# Altium schematic sheet main.SchDoc
size 223 x 203 mm; SheetNumber: 1; SheetTotal: 13
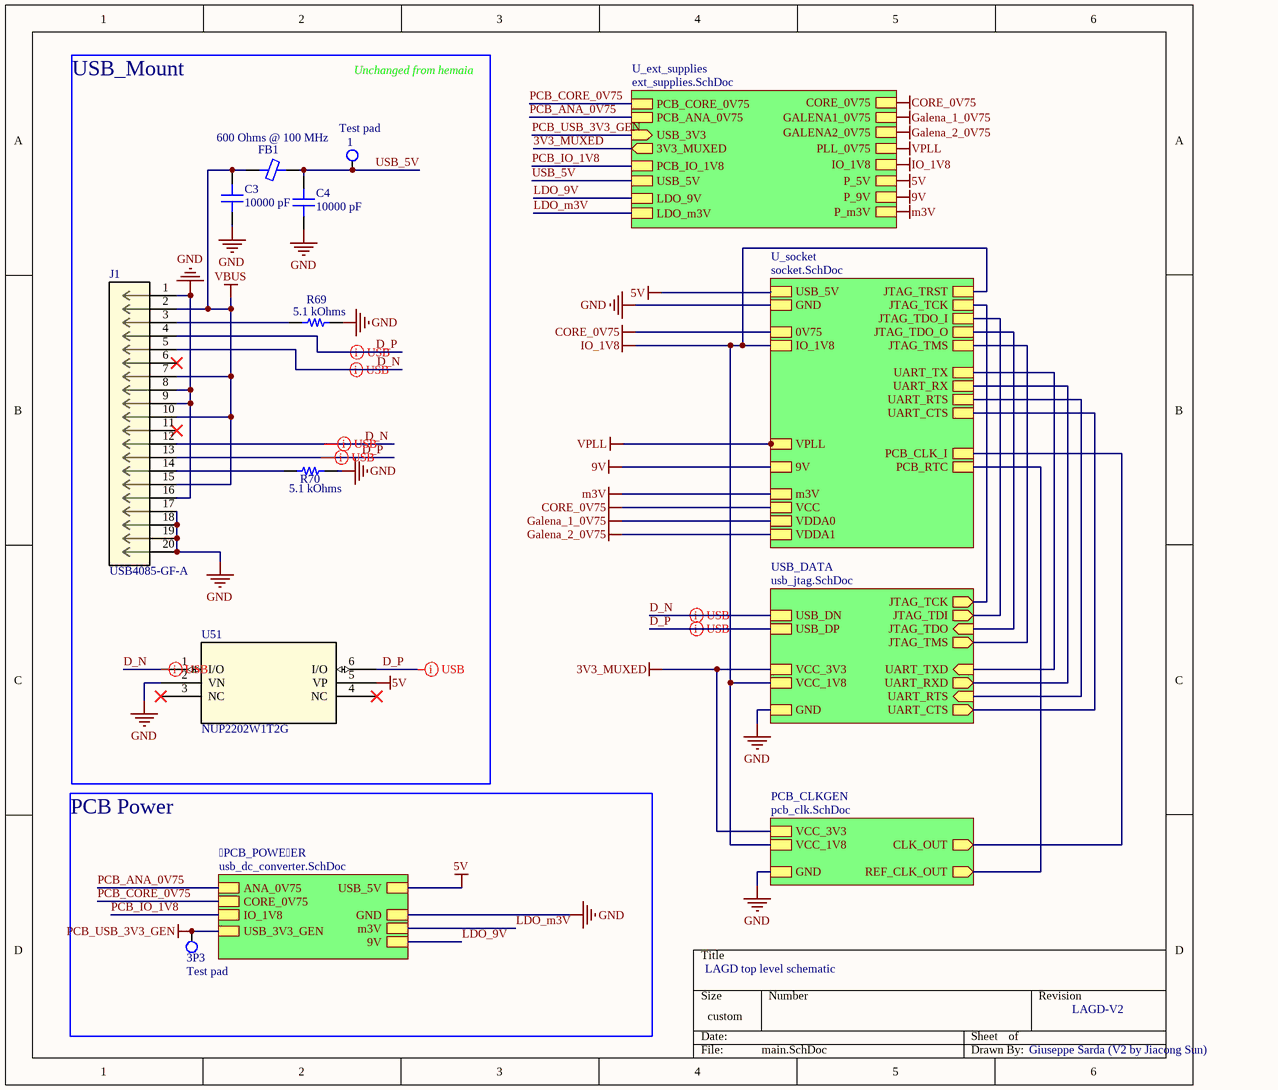
[diagram p0: main.SchDoc]

## Parts
1  Test pad  [Test Pad]
3P3  Test pad  [Test Pad]
C3  10000 pF  [CAP 0805_2012]
C4  10000 pF  [CAP 0805_2012]
FB1  600 Ohms @ 100 MHz  [FER 0805_2012]
J1  USB4085-GF-A  [FP-USB4085-GF-A-MFG]
R69  5.1 kOhms  [RES 0805_2012]
R70  5.1 kOhms  [RES 0805_2012]
U51  NUP2202W1T2G  [SOT-363-6_2P2X1P35_ONS]

## Blocks framed on the sheet
USB_Mount: 1 C3 C4 FB1 J1 R69 R70 U51
PCB Power: 3P3

## Sub-sheets
PCB_POWEER = usb_dc_converter.SchDoc: GND, USB_5V, ANA_0V75, CORE_0V75, IO_1V8, m3V, 9V, USB_3V3_GEN
PCB_CLKGEN = pcb_clk.SchDoc: VCC_3V3, VCC_1V8, GND, CLK_OUT (out), REF_CLK_OUT (out)
U_ext_supplies = ext_supplies.SchDoc: PCB_CORE_0V75, CORE_0V75, PCB_ANA_0V75, GALENA1_0V75, GALENA2_0V75, PLL_0V75, PCB_IO_1V8, IO_1V8, USB_5V, P_5V, LDO_9V, P_9V, LDO_m3V, P_m3V, USB_3V3 (in), 3V3_MUXED (out)
U_socket = socket.SchDoc: USB_5V, GND, 9V, 0V75, IO_1V8, VDDA1, PCB_RTC, PCB_CLK_I, UART_RTS, UART_TX, UART_RX, UART_CTS, JTAG_TCK, JTAG_TMS, JTAG_TDO_I, JTAG_TRST, JTAG_TDO_O, VCC, VDDA0, m3V, VPLL
USB_DATA = usb_jtag.SchDoc: VCC_1V8, VCC_3V3, GND, USB_DN, USB_DP, JTAG_TCK (out), JTAG_TDI (out), JTAG_TDO (in), JTAG_TMS (out), UART_TXD (in), UART_RXD (out), UART_RTS (in), UART_CTS (out)

## Nets
3V3_MUXED: sheet USB_DATA/VCC_3V3, sheet PCB_CLKGEN/VCC_3V3, sheet U_ext_supplies/3V3_MUXED
5V: U51.5(VP) ; sheet PCB_POWEER/USB_5V, sheet U_socket/USB_5V, sheet U_ext_supplies/P_5V
9V: sheet U_socket/9V, sheet U_ext_supplies/P_9V
CORE_0V75: sheet U_socket/0V75, sheet U_socket/VCC, sheet U_ext_supplies/CORE_0V75
Galena_1_0V75: sheet U_socket/VDDA0, sheet U_ext_supplies/GALENA1_0V75
Galena_2_0V75: sheet U_socket/VDDA1, sheet U_ext_supplies/GALENA2_0V75
GND: C3.2 C4.2 J1.1 J1.8 J1.9 J1.16 J1.17 J1.18 J1.19 J1.20 R69.2 R70.2 U51.2(VN) ; sheet USB_DATA/GND, sheet PCB_CLKGEN/GND, sheet PCB_POWEER/GND, sheet U_socket/GND
IO_1V8: sheet USB_DATA/VCC_1V8, sheet PCB_CLKGEN/VCC_1V8, sheet U_socket/IO_1V8, sheet U_socket/JTAG_TRST, sheet U_ext_supplies/IO_1V8
m3V: sheet U_socket/m3V, sheet U_ext_supplies/P_m3V
PCB_USB_3V3_GEN: 3P3.1 ; sheet PCB_POWEER/USB_3V3_GEN, sheet U_ext_supplies/USB_3V3
VBUS: C3.1 FB1.1 J1.2 J1.7 J1.10 J1.15
VPLL: sheet U_socket/VPLL, sheet U_ext_supplies/PLL_0V75
D_N: J1.5 J1.12 U51.1(I/O) ; sheet USB_DATA/USB_DN
D_P: J1.4 J1.13 U51.6(I/O) ; sheet USB_DATA/USB_DP
LDO_9V: sheet PCB_POWEER/9V, sheet U_ext_supplies/LDO_9V
LDO_m3V: sheet PCB_POWEER/m3V, sheet U_ext_supplies/LDO_m3V
PCB_ANA_0V75: sheet PCB_POWEER/ANA_0V75, sheet U_ext_supplies/PCB_ANA_0V75
PCB_CORE_0V75: sheet PCB_POWEER/CORE_0V75, sheet U_ext_supplies/PCB_CORE_0V75
PCB_IO_1V8: sheet PCB_POWEER/IO_1V8, sheet U_ext_supplies/PCB_IO_1V8
USB_5V: 1.1 C4.1 FB1.2 ; sheet U_ext_supplies/USB_5V
NetJ1_3: J1.3 R69.1
NetJ1_14: J1.14 R70.1
(unnamed): sheet USB_DATA/JTAG_TCK, sheet U_socket/JTAG_TCK
(unnamed): sheet USB_DATA/JTAG_TDI, sheet U_socket/JTAG_TDO_I
(unnamed): sheet USB_DATA/JTAG_TDO, sheet U_socket/JTAG_TDO_O
(unnamed): sheet USB_DATA/JTAG_TMS, sheet U_socket/JTAG_TMS
(unnamed): sheet USB_DATA/UART_TXD, sheet U_socket/UART_TX
(unnamed): sheet USB_DATA/UART_RXD, sheet U_socket/UART_RX
(unnamed): sheet USB_DATA/UART_RTS, sheet U_socket/UART_RTS
(unnamed): sheet USB_DATA/UART_CTS, sheet U_socket/UART_CTS
(unnamed): sheet PCB_CLKGEN/CLK_OUT, sheet U_socket/PCB_CLK_I
(unnamed): sheet PCB_CLKGEN/REF_CLK_OUT, sheet U_socket/PCB_RTC

Not connected (* = marked no-connect by the designer): J1 6* 11*; U51 3(NC)* 4(NC)*

## Layout directives
differential pair; differential pair class *; rule Differential Pairs Routing [Pref Gap = 10mil    Min Gap  = 10mil    Max Gap  = 10milPref Width = 15mil    Min Width  = 15mil    Max Width  = 15mil]: D_N
differential pair: D_N, D_P

## Notes on the sheet
- Unchanged from hemaia
- LAGD top level schematic
- LAGD-V2
- Giuseppe Sarda (V2 by Jiacong Sun)

## Library data of the parts
C3 C4 = C0805C103F3GECTU: CAP CER 0805 10NF 25V C0G 1%; manufacturer: KEMET; Temperature Coefficient: C0G, NP0; Part Number: C0805C103F3GECTU; Capacitance: 10000 pF; Applications: ESD Protection; componentlink1description: Datasheet; componentlink1url: https://search.kemet.com/download/datasheet/C0805C103F3GEC7800; componentlink2description: DigiKey Link; componentlink2url: https://www.digikey.com/en/products/detail/kemet/C0805C103F3GECTU/8644419; Device Package: 0805 (2012 Metric); Features: Low ESL, Low ESR; lastupdated: 4/6/2026 7:28:54 PM; Lifecycle Status: Active; Minimum Order: 1; Mounting Type: Surface Mount, MLCC; Operating Temperature: -55°C ~ 125°C; Package / Case: 0805 (2012 Metric); packaging: TapeAndReel; partid: 70642; price: 0.46; series: ESD SMD Comm C0G; Size / Dimension: 0.079" L x 0.049" W (2.00mm x 1.25mm); Supplier 1: DigiKey; Supplier Part Number 1: 399-C0805C103F3GECTUCT-ND; Thickness (Max): 0.039" (1.00mm); Tolerance: ±1%; value: 10000 pF; Voltage - Rated: 25V
FB1 = BLM21HE601SH1L: FERRITE BEAD 600 OHM 0805 1LN; Manufacturer: Murata Electronics; Current Rating (Max): 2.3A; DC Resistance (DCR) (Max): 55mOhm; Filter Type: Signal Line; Number of Lines: 1; Part Number: BLM21HE601SH1L; ComponentLink2Description: DigiKey Link; ComponentLink2URL: https://www.digikey.com/en/products/detail/murata-electronics/BLM21HE601SH1L/17184949; Device Package: 0805 (2012 Metric); Features: Automotive; Height (Max): 0.057" (1.45mm); Impedance @ Frequency: 600 Ohms @ 100 MHz; LastUpdated: 4/5/2026 8:28:54 PM; Lifecycle Status: Active; Minimum Order: 1; Mounting Type: Surface Mount; Operating Temperature: -55°C ~ 125°C; Package / Case: 0805 (2012 Metric); Packaging: TapeAndReel; PartId: 3271; Part Status: Active; Price: 0.12; Ratings: AEC-Q200; Series: BLM21H; Size / Dimension: 0.079" L x 0.049" W (2.00mm x 1.25mm); Supplier 1: DigiKey; Supplier Part Number 1: 490-BLM21HE601SH1LCT-ND; Value: 600 Ohms @ 100 MHz
J1 = USB4085-GF-A: Description; Manufacturer_Name: Global Connector Technology; Copyright: Copyright (C) 2025 Ultra Librarian. All rights reserved.; Manufacturer_Part_Number: USB4085-GF-A; RefDes: RefDes; Type: Type
R69 R70 = 560112120019: RES 5.1K OHM 5% 1/4W 0805; Manufacturer: Würth Elektronik; Power (Watts): 0.25W, 1/4W; Temperature Coefficient: ±100ppm/°C; Part Number: 560112120019; Value: 5.1 kOhms; ComponentLink1Description: Datasheet; ComponentLink1URL: https://www.we-online.com/katalog/datasheet/560112120019.pdf; ComponentLink2Description: DigiKey Link; ComponentLink2URL: https://www.digikey.com/en/products/detail/würth-elektronik/560112120019/22230497; Composition: Thick Film; Device Package: 0805 (2012 Metric); Features: Anti-Sulfur; Height - Seated (Max): 0.026" (0.65mm); LastUpdated: 4/6/2026 8:09:43 PM; Lifecycle Status: Active; Minimum Order: 1; Number of Terminations: 2; Operating Temperature: -55°C ~ 155°C; Package / Case: 0805 (2012 Metric); Packaging: TapeAndReel; PartId: 95975; Price: 0.03; Resistance: 5.1 kOhms; Series: WRIS-RSKS; Size / Dimension: 0.079" L x 0.049" W (2.00mm x 1.25mm); Supplier 1: DigiKey; Supplier Part Number 1: 732-560112120019CT-ND; Supplier Device Package: 0805; Tolerance: ±5%
U51 = NUP2202W1T2G: Description; Manufacturer_Name: onsemi; Copyright: Copyright (C) 2025 Ultra Librarian. All rights reserved.; Manufacturer_Part_Number: NUP2202W1T2G; RefDes: RefDes; Type: Type